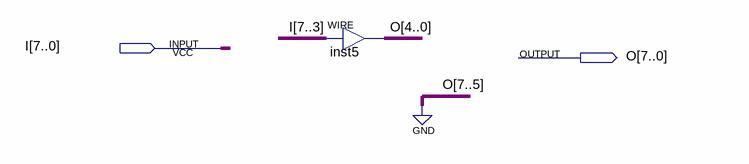
[diagram p0: schematic sheet]
// Quartus schematic ShR_3b.bdf as structural Verilog: 1 symbols, 2 pins
module ShR_3b (
  input  [7:0] I,
  output [7:0] O
);

  assign O[4:0] = I[7:3];  // WIRE inst5

  assign O[7:5] = 3'b000;
endmodule
